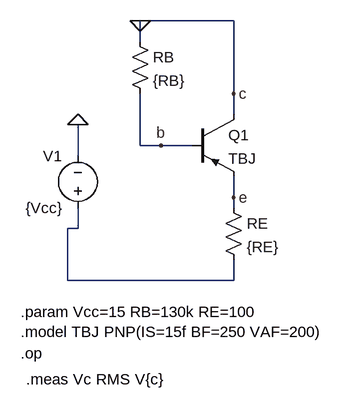
[diagram p0: schematic Q04 - Questão 3.asc]
Q04 - Questão 3.asc, the LTspice schematic file:
Version 4
SHEET 1 880 680
WIRE 336 0 192 0
WIRE 192 32 192 0
WIRE 336 112 336 0
WIRE 336 144 336 112
WIRE 192 192 192 112
WIRE 224 192 192 192
WIRE 272 192 224 192
WIRE 96 208 96 160
WIRE 336 272 336 240
WIRE 336 288 336 272
WIRE 96 320 96 288
WIRE 96 320 80 320
WIRE 80 400 80 320
WIRE 336 400 336 368
WIRE 336 400 80 400
FLAG 96 160 0
FLAG 192 0 0
FLAG 336 272 e
FLAG 336 112 c
FLAG 224 192 b
SYMBOL voltage 96 304 R180
WINDOW 0 24 96 Left 2
WINDOW 3 24 16 Left 2
SYMATTR InstName V1
SYMATTR Value {Vcc}
SYMBOL pnp 272 144 R0
SYMATTR InstName Q1
SYMATTR Value TBJ
SYMBOL res 320 272 R0
SYMATTR InstName RE
SYMATTR Value {RE}
SYMBOL res 176 16 R0
SYMATTR InstName RB
SYMATTR Value {RB}
TEXT 8 448 Left 2 !.param Vcc=15 RB=130k RE=100\n.model TBJ PNP(IS=15f BF=250 VAF=200)
TEXT 8 512 Left 2 !.op
TEXT 16 552 Left 2 !.meas Vc RMS V{c}

The netlist it stands for:
* Q04 - Questão 3.asc
V1 N001 0 {Vcc}
Q1 0 b e 0 TBJ
RE e N001 {RE}
RB 0 b {RB}
.model NPN NPN
.model PNP PNP
.lib standard.bjt
.param Vcc=15 RB=130k RE=100
.model TBJ PNP(IS=15f BF=250 VAF=200)
.op
.meas Vc RMS V{c}
.backanno
.end